# Altium schematic sheet 海关全向本体电路板V3_电平转换.SchDoc
size A4
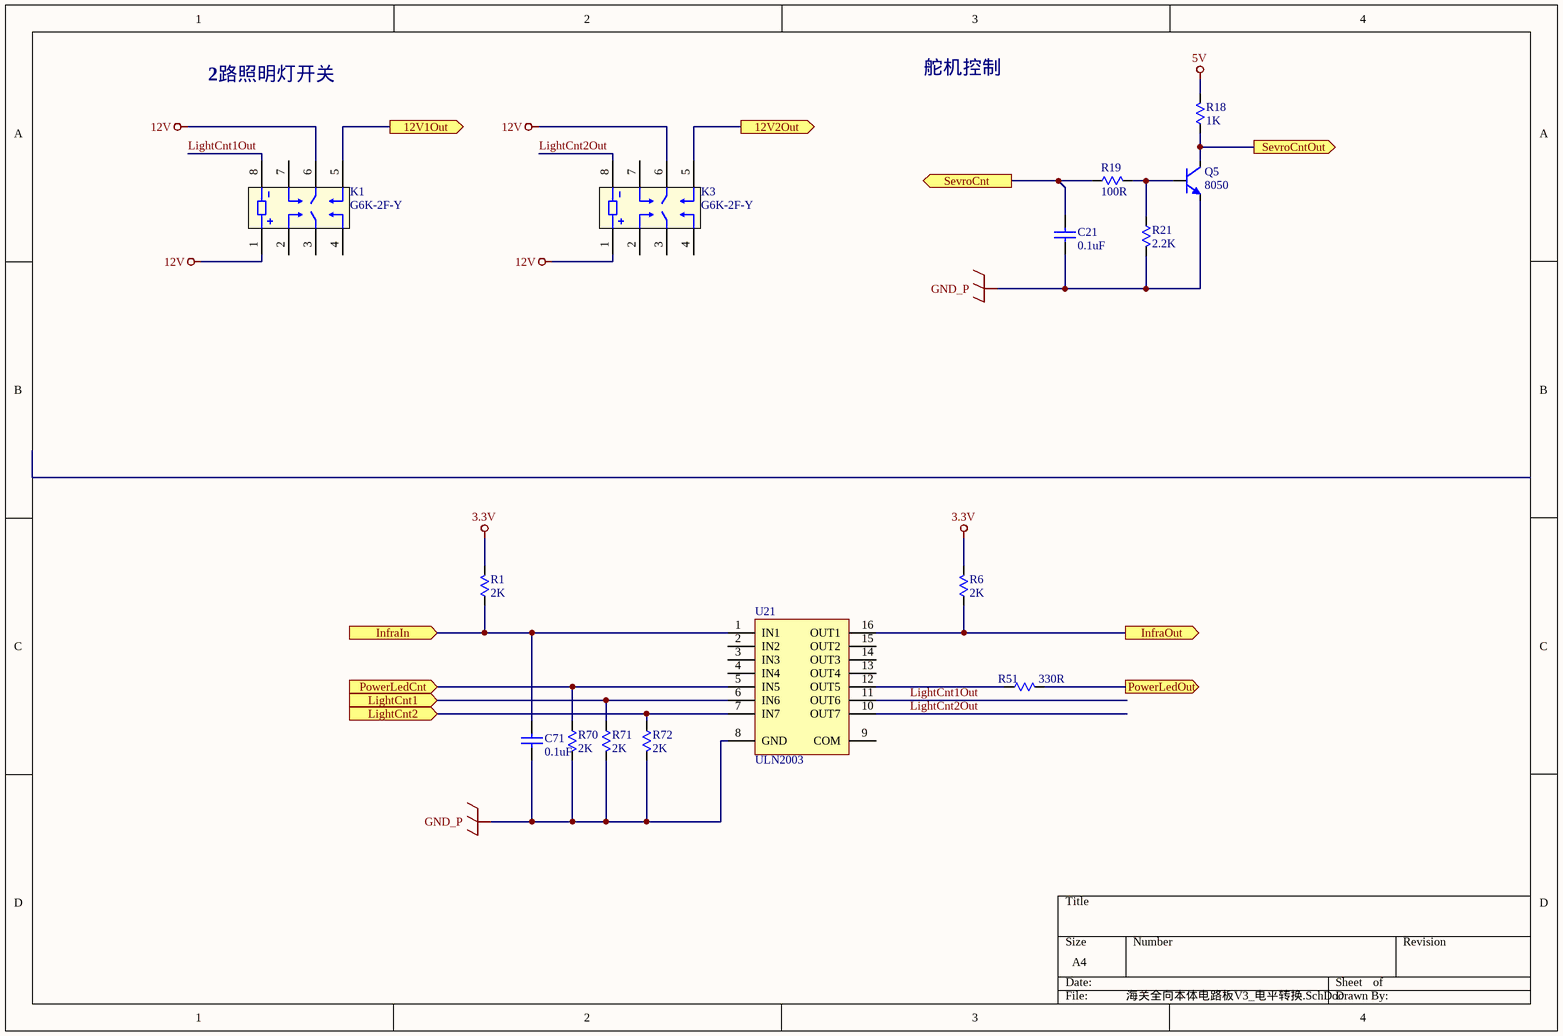
[diagram p0: 海关全向本体电路板V3_电平转换.SchDoc]

## Parts
C21  0.1uF  [C0603-S]
C71  0.1uF  [C0603-S]
K1  G6K-2F-Y  [G6K-2F-Y]
K3  G6K-2F-Y  [G6K-2F-Y]
Q5  8050  [SOT-23]
R1  2K  [R0603-S]
R6  2K  [R0603-S]
R18  1K  [R0603-S]
R19  100R  [R0603-S]
R21  2.2K  [R0603-S]
R51  330R  [R0603-S]
R70  2K  [R0603-S]
R71  2K  [R0603-S]
R72  2K  [R0603-S]
U21  ULN2003  [SO16-150]

## Ports
12V1Out (out), 12V2Out (out), InfraIn (in), InfraOut (out), LightCnt1 (in), LightCnt2 (in), PowerLedCnt (in), PowerLedOut (out), SevroCnt (out), SevroCntOut (out)

## Nets
3.3V: R1.1 R6.1
5V: R18.1
12V: K1.1 K1.6 K3.1 K3.6
GND_P: C21.1 C71.1 Q5.2(E) R21.1 R70.1 R71.1 R72.1 U21.8(GND)
12V1Out: K1.5 ; port 12V1Out
12V2Out: K3.5 ; port 12V2Out
InfraIn: C71.2 R1.2 U21.1(IN1) ; port InfraIn
InfraOut: R6.2 U21.16(OUT1) ; port InfraOut
LightCnt1: R71.2 U21.6(IN6) ; port LightCnt1
LightCnt1Out: K1.8 U21.11(OUT6)
LightCnt2: R72.2 U21.7(IN7) ; port LightCnt2
LightCnt2Out: K3.8 U21.10(OUT7)
PowerLedCnt: R70.2 U21.5(IN5) ; port PowerLedCnt
PowerLedOut: R51.1 ; port PowerLedOut
SevroCnt: C21.2 R19.2 ; port SevroCnt
SevroCntOut: Q5.3(C) R18.2 ; port SevroCntOut
NetQ5_1: Q5.1(B) R19.1 R21.2
NetR51_2: R51.2 U21.12(OUT5)

Not connected (* = marked no-connect by the designer): K1 2 3 4 7; K3 2 3 4 7; U21 2(IN2) 3(IN3) 4(IN4) 9(COM) 13(OUT4) 14(OUT3) 15(OUT2)

## Notes on the sheet
- 2路照明灯开关
- 舵机控制

## Library data of the parts
C21 C71 = Cap: Capacitor; Value: 22pF; Published: 8-Jun-2000; Revision: July-2002: Re-released for DXP Platform.; Publisher: Altium Limited
Q5 = NPN: NPN General Purpose Amplifier; Published: 8-Jun-2000; LatestRevisionDate: 15-Jan-2003; LatestRevisionNote: PCB Footprint 'BCY-W3/D4.7' replaced; DatasheetDocument: 1997; PackageDocument: Sep-1998; PackageReference: TO-92A; Publisher: Altium Limited; Code_JEDEC: TO-92A; ComponentLink1Description: Manufacturer Link; ComponentLink1URL: http://www.fairchildsemi.com/; ComponentLink2Description: Datasheet; ComponentLink2URL: http://www.fairchildsemi.com/ds/2N%2F2N3904.pdf
R1 R6 R21 R51 R70-R72 = Res: Resistor; Published: 8-Jun-2000; LatestRevisionDate: 04-Mar-2005; LatestRevisionNote: PCB Footprint replaced.; PackageReference: J1-0603; Publisher: Altium Limited
  R1 R6 R70-R72: Value: 2K
  R21: Value: 2.2K
  R51: Value: 330R
R18 R19 = RES: Resistor; Published: 8-Jun-2000; LatestRevisionDate: 17-Jul-2002; LatestRevisionNote: Re-released for DXP Platform.; PackageReference: AXIAL-0.3; Publisher: Altium Limited
  R18: Value: 1K
  R19: Value: 100R